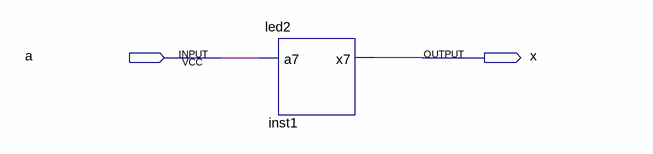
[diagram p0: schematic sheet]
// Quartus schematic LED.bdf as structural Verilog: 1 symbols, 2 pins
module LED (
  input  a,
  output x
);

  led2 inst1 (.a7(a), .x7(x));
endmodule
